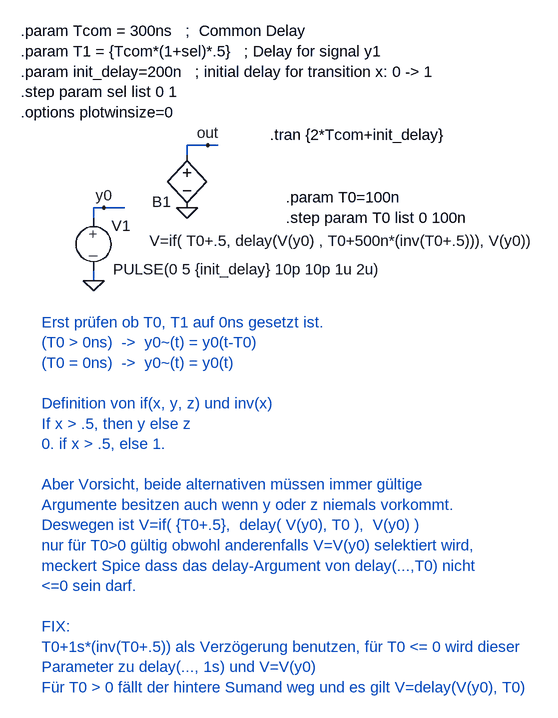
[diagram p0: schematic delay_bv_zero_argument_FIX.asc]
delay_bv_zero_argument_FIX.asc, the LTspice schematic file:
Version 4
SHEET 1 2240 1080
WIRE 416 288 384 288
WIRE 432 288 416 288
WIRE 384 304 384 288
WIRE 256 384 240 384
WIRE 288 384 256 384
WIRE 240 400 240 384
WIRE 240 496 240 480
FLAG 384 384 0
FLAG 416 288 out
FLAG 256 384 y0
FLAG 240 496 0
SYMBOL bv 384 288 R0
WINDOW 0 -54 87 Left 2
WINDOW 3 -58 147 Left 2
SYMATTR InstName B1
SYMATTR Value V=if( T0+.5, delay(V(y0) , T0+500n*(inv(T0+.5))), V(y0))
SYMBOL source-V 240 384 R0
WINDOW 123 0 0 Left 2
WINDOW 39 0 0 Left 2
WINDOW 3 30 95 Left 2
SYMATTR Value PULSE(0 5 {init_delay} 10p 10p 1u 2u)
SYMATTR InstName V1
TEXT 128 112 Left 2 !.param Tcom = 300ns   ;  Common Delay \n.param T1 = {Tcom*(1+sel)*.5}   ; Delay for signal y1\n.param init_delay=200n   ; initial delay for transition x: 0 -> 1\n.step param sel list 0 1\n.options plotwinsize=0
TEXT 512 272 Left 2 !.tran {2*Tcom+init_delay}
TEXT 160 560 Left 2 ;Erst prüfen ob T0, T1 auf 0ns gesetzt ist.\n(T0 > 0ns)  ->  y0~(t) = y0(t-T0)\n(T0 = 0ns)  ->  y0~(t) = y0(t)\n \nDefinition von if(x, y, z) und inv(x)\nIf x > .5, then y else z\n0. if x > .5, else 1. \n \nAber Vorsicht, beide alternativen müssen immer gültige \nArgumente besitzen auch wenn y oder z niemals vorkommt.\nDeswegen ist V=if( {T0+.5},  delay( V(y0), T0 ),  V(y0) )\nnur für T0>0 gültig obwohl anderenfalls V=V(y0) selektiert wird,\nmeckert Spice dass das delay-Argument von delay(...,T0) nicht \n<=0 sein darf.\n \nFIX: \nT0+1s*(inv(T0+.5)) als Verzögerung benutzen, für T0 <= 0 wird dieser\nParameter zu delay(..., 1s) und V=V(y0)\nFür T0 > 0 fällt der hintere Sumand weg und es gilt V=delay(V(y0), T0)
TEXT 536 368 Left 2 !.param T0=100n\n.step param T0 list 0 100n

The netlist it stands for:
* delay_bv_zero_argument_FIX.asc
B1 out 0 V=if( T0+.5, delay(V(y0) , T0+500n*(inv(T0+.5))), V(y0))
V1 y0 0 PULSE(0 5 {init_delay} 10p 10p 1u 2u)
.param Tcom = 300ns   ;  Common Delay
.param T1 = {Tcom*(1+sel)*.5}   ; Delay for signal y1
.param init_delay=200n   ; initial delay for transition x: 0 -> 1
.step param sel list 0 1
.options plotwinsize=0
.tran {2*Tcom+init_delay}
* Erst prüfen ob T0, T1 auf 0ns gesetzt ist.
* (T0 > 0ns)  ->  y0~(t) = y0(t-T0)
* (T0 = 0ns)  ->  y0~(t) = y0(t)
* Definition von if(x, y, z) und inv(x)
* If x > .5, then y else z
* 0. if x > .5, else 1.
* Aber Vorsicht, beide alternativen müssen immer gültige
* Argumente besitzen auch wenn y oder z niemals vorkommt.
* Deswegen ist V=if( {T0+.5},  delay( V(y0), T0 ),  V(y0) )
* nur für T0>0 gültig obwohl anderenfalls V=V(y0) selektiert wird,
* meckert Spice dass das delay-Argument von delay(...,T0) nicht
* <=0 sein darf.
* FIX:
* T0+1s*(inv(T0+.5)) als Verzögerung benutzen, für T0 <= 0 wird dieser
* Parameter zu delay(..., 1s) und V=V(y0)
* Für T0 > 0 fällt der hintere Sumand weg und es gilt V=delay(V(y0), T0)
.param T0=100n
.step param T0 list 0 100n
.backanno
.end